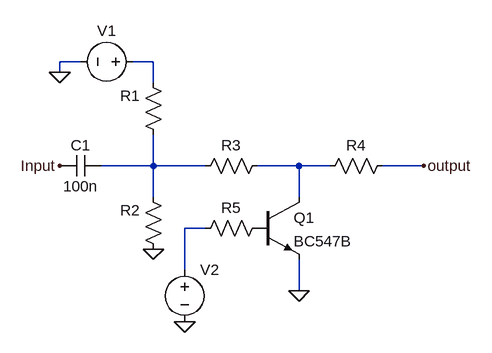
[diagram p0: schematic Draft3.asc]
Draft3.asc, the LTspice schematic file:
Version 4
SHEET 1 880 680
WIRE -256 0 -288 0
WIRE -144 0 -176 0
WIRE -288 16 -288 0
WIRE -144 32 -144 0
WIRE -144 160 -144 112
WIRE -144 160 -224 160
WIRE -64 160 -144 160
WIRE 80 160 16 160
WIRE 128 160 80 160
WIRE 272 160 208 160
WIRE -144 208 -144 160
WIRE 80 208 80 160
WIRE -64 256 -96 256
WIRE -96 320 -96 256
WIRE 80 352 80 304
FLAG -144 288 0
FLAG 80 352 0
FLAG -288 16 0
FLAG -96 400 0
FLAG -288 160 Input
FLAG 272 160 output
SYMBOL res -128 128 R180
WINDOW 0 36 76 Left 0
WINDOW 3 36 40 Left 0
SYMATTR InstName R1
SYMATTR Value ""
SYMBOL res -128 304 R180
WINDOW 0 36 76 Left 0
WINDOW 3 36 40 Left 0
SYMATTR InstName R2
SYMATTR Value ""
SYMBOL res 32 144 R90
WINDOW 0 0 56 VBottom 0
WINDOW 3 32 56 VTop 0
SYMATTR InstName R3
SYMATTR Value ""
SYMBOL res 224 144 R90
WINDOW 0 0 56 VBottom 0
WINDOW 3 32 56 VTop 0
SYMATTR InstName R4
SYMATTR Value ""
SYMBOL cap -224 144 R90
WINDOW 0 0 32 VBottom 0
WINDOW 3 32 32 VTop 0
SYMATTR InstName C1
SYMATTR Value 100n
SYMBOL npn 16 208 R0
SYMATTR InstName Q1
SYMATTR Value BC547B
SYMBOL res 32 240 R90
WINDOW 0 0 56 VBottom 0
WINDOW 3 32 56 VTop 0
SYMATTR InstName R5
SYMATTR Value ""
SYMBOL voltage -160 0 R90
WINDOW 0 -32 56 VBottom 0
WINDOW 3 32 56 VTop 0
WINDOW 123 0 0 Left 0
WINDOW 39 0 0 Left 0
SYMATTR InstName V1
SYMATTR Value ""
SYMBOL voltage -96 304 R0
WINDOW 123 0 0 Left 0
WINDOW 39 0 0 Left 0
SYMATTR InstName V2
SYMATTR Value ""

The netlist it stands for:
* Draft3.asc
R1 N002 N001
R2 0 N002
R3 N003 N002
R4 output N003
C1 N002 Input 100n
Q1 N003 P001 0 0 BC547B
R5 P001 N004
V1 N001 0
V2 N004 0
.model NPN NPN
.model PNP PNP
.lib standard.bjt
.backanno
.end